# Altium schematic sheet Peripheral.SchDoc
size A3; SheetNumber: 5; SheetTotal: 6
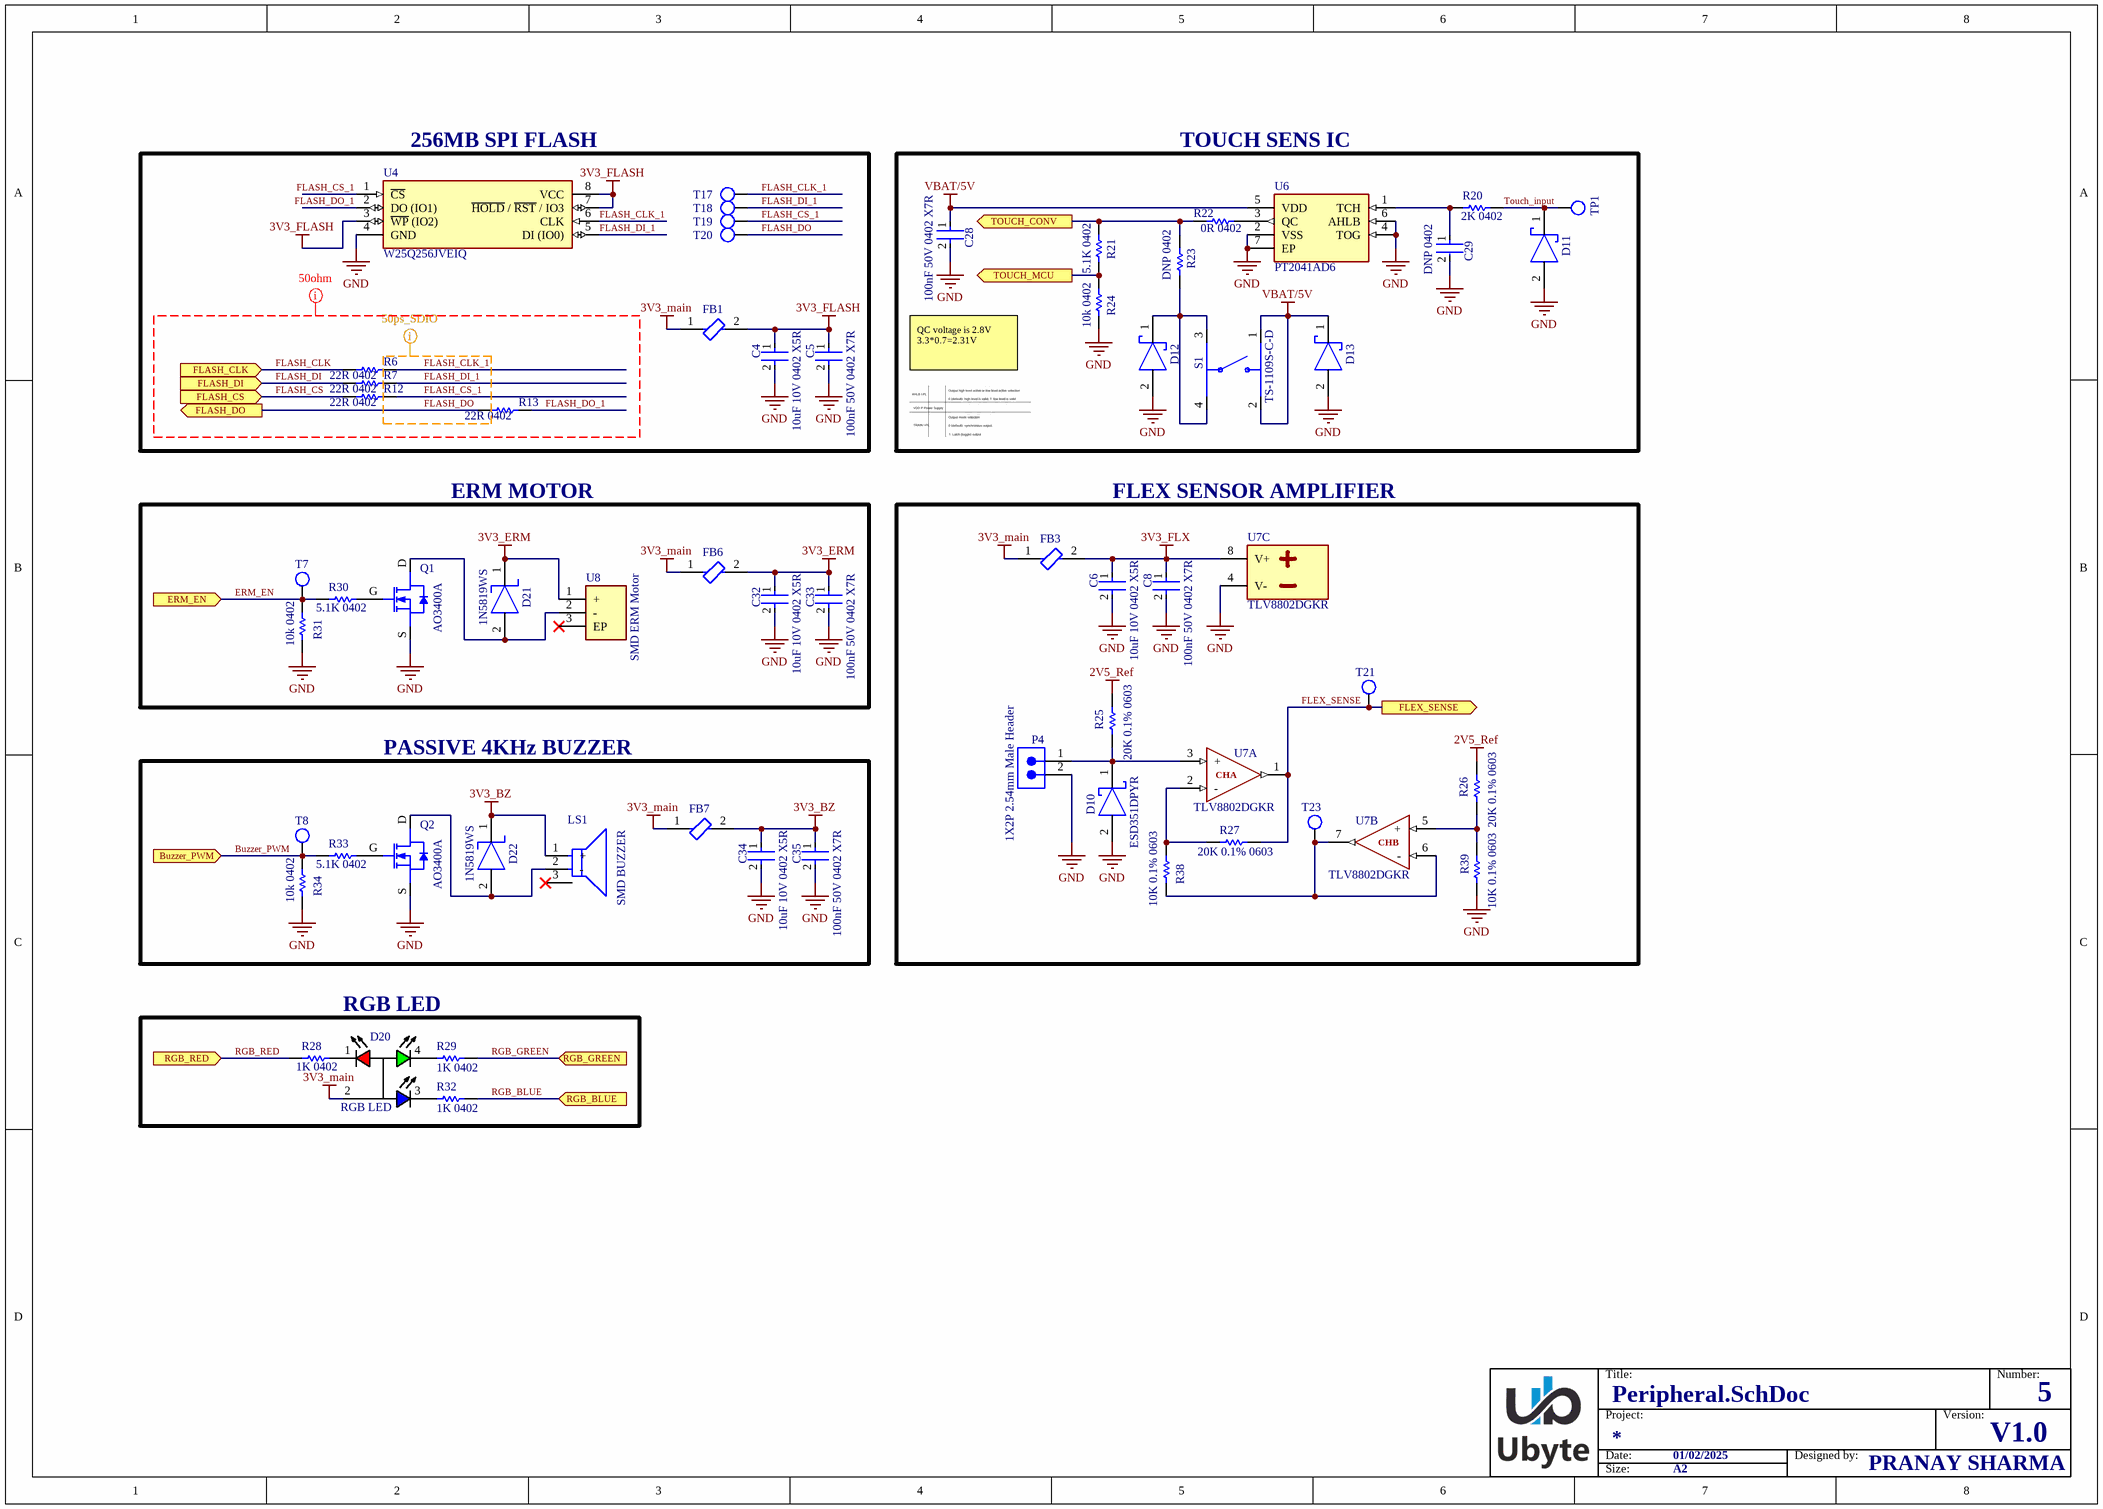
[diagram p0: Peripheral.SchDoc]

## Parts
C4  10uF 10V 0402 X5R  [0402 IPC CLASS C CAPACITOR]
C5  100nF 50V 0402 X7R  [0402 IPC CLASS C CAPACITOR]
C6  10uF 10V 0402 X5R  [0402 IPC CLASS C CAPACITOR]
C8  100nF 50V 0402 X7R  [0402 IPC CLASS C CAPACITOR]
C28  100nF 50V 0402 X7R  [0402 IPC CLASS C CAPACITOR]
C29  DNP 0402  [0402 IPC Class C Capacitor]  (no BOM)
C32  10uF 10V 0402 X5R  [0402 IPC CLASS C CAPACITOR]
C33  100nF 50V 0402 X7R  [0402 IPC CLASS C CAPACITOR]
C34  10uF 10V 0402 X5R  [0402 IPC CLASS C CAPACITOR]
C35  100nF 50V 0402 X7R  [0402 IPC CLASS C CAPACITOR]
D10  ESD351DPYR  [DPY0002A IPC-C]
D11  SP3031-01ETG  [SOD882 IPC-C]  (value not drawn)
D12  SP3031-01ETG  [SOD882 IPC-C]  (value not drawn)
D13  SP3031-01ETG  [SOD882 IPC-C]  (value not drawn)
D20  RGB LED  [NH-B1515RGBA-HF IPC-C]
D21  1N5819WS  [SOD-323 IPC-C]
D22  1N5819WS  [SOD-323 IPC-C]
FB1  BLM15AX102SN1D  [0402 IPC CLASS C FERRITE BEAD]  (value not drawn)
FB3  BLM15AX102SN1D  [0402 IPC CLASS C FERRITE BEAD]  (value not drawn)
FB6  BLM15AX102SN1D  [0402 IPC CLASS C FERRITE BEAD]  (value not drawn)
FB7  BLM15AX102SN1D  [0402 IPC CLASS C FERRITE BEAD]  (value not drawn)
LS1  SMD BUZZER  [MLT-5020]
P4  1X2P 2.54mm Male Header  [2P 2.54mm Open Header]
Q1  AO3400A  [SOT-23 IPC-C]
Q2  AO3400A  [SOT-23 IPC-C]
R6  22R 0402  [0402 IPC CLASS C RESISTOR]
R7  22R 0402  [0402 IPC CLASS C RESISTOR]
R12  22R 0402  [0402 IPC CLASS C RESISTOR]
R13  22R 0402  [0402 IPC CLASS C RESISTOR]
R20  2K 0402  [0402 IPC CLASS C RESISTOR]
R21  5.1K 0402  [0402 IPC CLASS C RESISTOR]
R22  0R 0402  [0402 IPC CLASS B RESISTOR]
R23  DNP 0402  [0402 IPC CLASS B RESISTOR]  (no BOM)
R24  10k 0402  [0402 IPC CLASS C RESISTOR]
R25  20K 0.1% 0603  [0603 IPC CLASS C RESISTOR]
R26  20K 0.1% 0603  [0603 IPC CLASS C RESISTOR]
R27  20K 0.1% 0603  [0603 IPC CLASS C RESISTOR]
R28  1K 0402  [0402 IPC CLASS C RESISTOR]
R29  1K 0402  [0402 IPC CLASS C RESISTOR]
R30  5.1K 0402  [0402 IPC CLASS C RESISTOR]
R31  10k 0402  [0402 IPC CLASS C RESISTOR]
R32  1K 0402  [0402 IPC CLASS C RESISTOR]
R33  5.1K 0402  [0402 IPC CLASS C RESISTOR]
R34  10k 0402  [0402 IPC CLASS C RESISTOR]
R38  10K 0.1% 0603  [0603 IPC CLASS C RESISTOR]
R39  10K 0.1% 0603  [0603 IPC CLASS C RESISTOR]
S1  TS-1109S-C-D  [TS-1127-C]
T7  (no value)  [Test Point TH]  (no BOM)
T8  (no value)  [Test Point TH]  (no BOM)
T17  TP  [Testpoint1]  (value not drawn)  (no BOM)
T18  TP  [Testpoint1]  (value not drawn)  (no BOM)
T19  TP  [Testpoint1]  (value not drawn)  (no BOM)
T20  TP  [Testpoint1]  (value not drawn)  (no BOM)
T21  TP  [Testpoint1]  (value not drawn)  (no BOM)
T23  TP  [Testpoint1]  (value not drawn)  (no BOM)
TP1  Test Point TH  [Test Point TH]  (value not drawn)  (no BOM)
U4  W25Q256JVEIQ  [8-Pad WSON 8x6-mm IPC-C]
U6  PT2041AD6  [DFN2X2-6L IPC-C]
U7  TLV8802DGKR  [DGK0008A IPC-C]  (parts A,B,C of 3)
U8  SMD ERM Motor  [Z3OC1T8219731]

## Blocks framed on the sheet
256MB SPI FLASH: C4 C5 FB1 R6 R7 R12 R13 T17-T20 U4
TOUCH SENS IC: C28 C29 D11-D13 R20-R24 S1 TP1 U6
ERM MOTOR: C32 C33 D21 FB6 Q1 R30 R31 T7 U8
FLEX SENSOR AMPLIFIER: C6 C8 D10 FB3 P4 R25-R27 R38 R39 T21 T23 U7
PASSIVE 4KHz BUZZER: C34 C35 D22 FB7 LS1 Q2 R33 R34 T8
RGB LED: D20 R28 R29 R32

## Ports
Buzzer_PWM (in), ERM_EN (in), FLASH_CLK (in), FLASH_CS (in), FLASH_DI (in), FLASH_DO (out), FLEX_SENSE (out), RGB_BLUE (in), RGB_GREEN (in), RGB_RED (in), TOUCH_CONV (out), TOUCH_MCU (out)

## Nets
2V5_Ref: R25.2 R26.2
3V3_BZ: C34.1 C35.1 D22.1(C) FB7.2 LS1.1(+)
3V3_ERM: C32.1 C33.1 D21.1(C) FB6.2 U8.1(+)
3V3_FLASH: C4.1 C5.1 FB1.2 U4.3(~{WP}_(IO2)) U4.7(~{HOLD}_/_~{RST}_/_IO3) U4.8(VCC)
3V3_FLX: C6.1 C8.1 FB3.2 U7.8(V+)
3V3_main: D20.2(COM+) FB1.1 FB3.1 FB6.1 FB7.1
GND: C4.2 C5.2 C6.2 C8.2 C28.2 C29.2 C32.2 C33.2 C34.2 C35.2 D10.2(K2) D11.2(A) D12.2(A) D13.2(A) P4.2 Q1.S(SOURCE) Q2.S(SOURCE) R24.2 R31.1 R34.1 R39.1 U4.4(GND) U6.2(VSS) U6.4(TOG) U6.6(AHLB) U6.7(EP) U7.4(V-)
VBAT/5V: C28.1 D13.1(C) S1.1 S1.2 U6.5(VDD)
Buzzer_PWM: R33.1 R34.2 T8.0 ; port Buzzer_PWM
ERM_EN: R30.1 R31.2 T7.0 ; port ERM_EN
FLASH_CLK: R6.1 ; port FLASH_CLK
FLASH_CLK_1: R6.2 T17.0 U4.6(CLK)
FLASH_CS: R12.1 ; port FLASH_CS
FLASH_CS_1: R12.2 T19.0 U4.1(~{CS})
FLASH_DI: R7.1 ; port FLASH_DI
FLASH_DI_1: R7.2 T18.0 U4.5(DI_(IO0))
FLASH_DO: R13.1 T20.0 ; port FLASH_DO
FLASH_DO_1: R13.2 U4.2(DO_(IO1))
FLEX_SENSE: R27.1 T21.0 U7.1(OUT1) ; port FLEX_SENSE
RGB_BLUE: R32.2 ; port RGB_BLUE
RGB_GREEN: R29.2 ; port RGB_GREEN
RGB_RED: R28.1 ; port RGB_RED
TOUCH_CONV: R21.2 R22.2 R23.1 ; port TOUCH_CONV
Touch_input: D11.1(C) R20.2 TP1.0
TOUCH_MCU: R21.1 R24.1 ; port TOUCH_MCU
NetC29_1: C29.1 R20.1 U6.1(TCH)
NetD10_1: D10.1(K1) P4.1 R25.1 U7.3(+)
NetD12_1: D12.1(C) R23.2 S1.3 S1.4
NetD20_1: D20.1(R-) R28.2
NetD20_3: D20.3(B-) R32.1
NetD20_4: D20.4(G-) R29.1
NetD21_2: D21.2(A) Q1.D(DRAIN) U8.2(-)
NetD22_2: D22.2(A) LS1.2(-) Q2.D(DRAIN)
NetQ1_G: Q1.G(GATE) R30.2
NetQ2_G: Q2.G(GATE) R33.2
NetR22_1: R22.1 U6.3(QC)
NetR26_1: R26.1 R39.2 U7.5(+)
NetR27_2: R27.2 R38.2 U7.2(-)
NetR38_1: R38.1 T23.0 U7.6(-) U7.7(OUT1)

Not connected (* = marked no-connect by the designer): LS1 3(A)*; U8 3(EP)*

## Layout directives
net class 50ps_SDIO: FLASH_CLK_1, FLASH_CS_1, FLASH_DI_1, FLASH_DO
net class 50ohm: FLASH_CLK, FLASH_CLK_1, FLASH_CS, FLASH_CS_1, FLASH_DI, FLASH_DI_1, FLASH_DO, FLASH_DO_1

## Notes on the sheet
- QC voltage is 2.8V
  3.3*0.7=2.31V
- Title:
- Number:
- Date:
- Project:
- 01/02/2025
- Designed by:
- Version:
- V1.0
- Size:
- A2
- PRANAY SHARMA
- (in symbol TLV8802DGKR, part A) CHA
- (in symbol TLV8802DGKR, part B) CHB

## Library data of the parts
C29 = Capacitor 0402
D20 = NH-B1515RGBA-HF
LS1 = MLT-5020
R6 R7 R12 R13 = 22R 1% 0402
R20 = 2K 1% 0402
R21 R30 R33 = 5.1K 1% 0402
R22 R23 = 0R 1% 0402
R24 R31 R34 = 10k 1% 0402
R28 R29 R32 = 1K 1% 0402
S1 = TS-1127-C
T7 T8 = Test Point TH
T17-T21 T23 = Testpoint1
U8 = Z3OC1T8219731